# Altium schematic sheet pca20054_sheet5_connectors.SchDoc: PCA20054 - Connectors
size A3; Organization: Nordic Semiconductor; DocumentNumber: 1; Revision: 1.0.0; SheetNumber: 5; SheetTotal: 5; Date: 2020-02-07; CompanyName: Nordic Semiconductor; DrawnBy: KJP; ProjectNumber: 4467
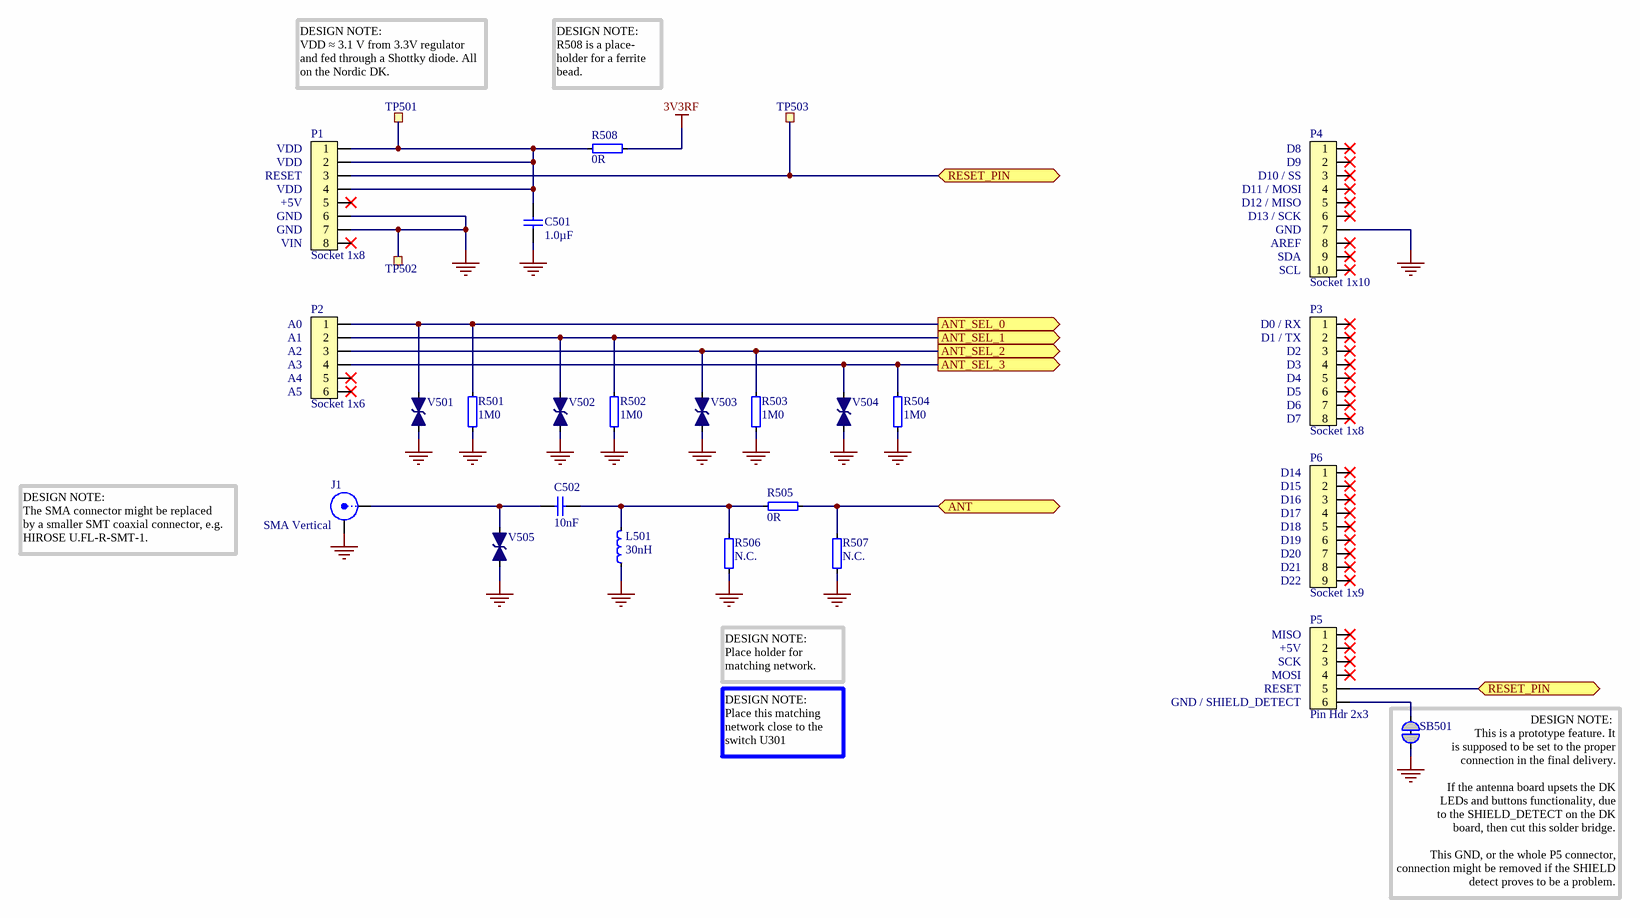
[diagram p0: pca20054_sheet5_connectors.SchDoc]

## Parts
C501  1.0µF  [CAPC1608X06L]
C502  10nF  [CAPC1005X04L]
J1  SMA Vertical  [CON_SMA_COAX_FEM_STRAIGHT_5P_1]
L501  30nH  [INDC1005X04L_WW]
P1  Socket 1x8  [SOCKET_1x8_SMD]
P2  Socket 1x6  [SOCKET_1x6_SMD]
P3  Socket 1x8  [SOCKET_1x8_SMD]
P4  Socket 1x10  [SOCKET_1x10_SMD]
P5  Pin Hdr 2x3  [HDR_2x3-SMD]
P6  Socket 1x9  [SOCKET_1x9_SMD]
R501  1M0  [RESC1005X04L]
R502  1M0  [RESC1005X04L]
R503  1M0  [RESC1005X04L]
R504  1M0  [RESC1005X04L]
R505  0R  [RESC1005X04L]
R506  N.C.  [RESC1005X04L_NC]
R507  N.C.  [RESC1005X04L_NC]
R508  0R  [RESC1005X04L]
SB501  Solderbridge  [Solderbridge_Shorted_Power]  (value not drawn)  (net tie, no BOM)
TP501  Ø1.0mm,SMD  [TP_SMD_Ø1.0mm]  (value not drawn)  (no BOM)
TP502  Ø1.0mm,SMD  [TP_SMD_Ø1.0mm]  (value not drawn)  (no BOM)
TP503  Ø1.0mm,SMD  [TP_SMD_Ø1.0mm]  (value not drawn)  (no BOM)
V501  LXES15AAA1-133  [RESC1005X04L]  (value not drawn)
V502  LXES15AAA1-133  [RESC1005X04L]  (value not drawn)
V503  LXES15AAA1-133  [RESC1005X04L]  (value not drawn)
V504  LXES15AAA1-133  [RESC1005X04L]  (value not drawn)
V505  LXES15AAA1-133  [RESC1005X04L]  (value not drawn)

## Ports
ANT (bidir), ANT_SEL_0 (out), ANT_SEL_1 (out), ANT_SEL_2 (out), ANT_SEL_3 (out), RESET_PIN (bidir)

## Nets
3V3RF: R508.2
GND: C501.1 J1.2(Y) L501.1 P1.6 P1.7 P4.7 R501.1 R502.1 R503.1 R504.1 R506.1 R507.1 SB501.2 TP502.1 V501.2 V502.2 V503.2 V504.2 V505.2
ANT: R505.2 R507.2 ; port ANT
ANT_SEL_0: P2.1 R501.2 V501.1 ; port ANT_SEL_0
ANT_SEL_1: P2.2 R502.2 V502.1 ; port ANT_SEL_1
ANT_SEL_2: P2.3 R503.2 V503.1 ; port ANT_SEL_2
ANT_SEL_3: P2.4 R504.2 V504.1 ; port ANT_SEL_3
RESET_PIN: P1.3 P5.5 TP503.1 ; port RESET_PIN
NetC501_2: C501.2 P1.1 P1.2 P1.4 R508.1 TP501.1
NetC502_1: C502.1 L501.2 R505.1 R506.2
NetC502_2: C502.2 J1.1(X) V505.1
NetP5_6: P5.6 SB501.1

Not connected (* = marked no-connect by the designer): P1 5* 8*; P2 5* 6*; P3 1* 2* 3* 4* 5* 6* 7* 8*; P4 1* 2* 3* 4* 5* 6* 8* 9* 10*; P5 1* 2* 3* 4*; P6 1* 2* 3* 4* 5* 6* 7* 8* 9*

## Notes on the sheet
- (near TP501) DESIGN NOTE:
  VDD ≈ 3.1 V from 3.3V regulator and fed through a Shottky diode. All on the Nordic DK.
- DESIGN NOTE:
  R508 is a place-
  holder for a ferrite bead.
- (near P1) VDD
- (near P1) RESET
- (near P4) D8
- (near P4) D9
- (near P4) D10 / SS
- (near P4) D11 / MOSI
- (near P1) +5V
- (near P1) GND
- (near P1) VIN
- (near P4) D12 / MISO
- (near P4) D13 / SCK
- (near P4) GND
- (near P4) AREF
- (near P4) SDA
- (near P4) SCL
- (near P2) A0
- (near P3) D0 / RX
- (near P2) A1
- (near P2) A2
- (near P2) A3
- (near P2) A4
- (near P2) A5
- (near P3) D1 / TX
- (near P3) D2
- (near P3) D3
- (near P3) D4
- (near P3) D5
- (near P3) D6
- (near P3) D7
- (near P6) D14
- (near P6) D15
- (near P6) D16
- (near P6) D17
- (near P6) D18
- (near P6) D19
- DESIGN NOTE:
  The SMA connector might be replaced
  by a smaller SMT coaxial connector, e.g.
  HIROSE U.FL-R-SMT-1.
- (near P6) D20
- (near P6) D21
- (near P6) D22
- (near P5) MISO
- (near P5) +5V
- (near P5) SCK
- (near P5) MOSI
- DESIGN NOTE:
  Place holder for matching network.
- (near P5) RESET
- (near P5) GND / SHIELD_DETECT
- DESIGN NOTE:
  Place this matching network close to the switch U301
- (near SB501) DESIGN NOTE:
  This is a prototype feature. It
  is supposed to be set to the proper
  connection in the final delivery.
  If the antenna board upsets the DK
  LEDs and buttons functionality, due
  to the SHIELD_DETECT on the DK
  board, then cut this solder bridge.
  This GND, or the whole P5 connector, connection might be removed if the SHIELD detect proves to be a problem.
- Size
- Date:
- Project Number
- Sheet         of
- Revision
- File:
- Drawn By:

## Library data of the parts
C501 = C0603-1µ0: Capacitor, X7R, ±10%; Part number IPS: 00000000616; Note: 16V; Artikkelnr Noca: 20039282; Part Number: C0603-1µ0; Manufacturer: *; Manufacturer Part Number: *; ComponentLink1URL: *; ComponentLink1Description: Datasheet; ComponentLink2URL: *; ComponentLink2Description: Supplier link; HelpURL: *; Footprint Doc: 0603; LatestRevisionDate: 2013-06-05; Pin Count: 2; Publisher: Nordic Semiconductor; Published: 2009-05-08; Value: 1.0µF; Supplier 1: *; Supplier Part Number 1: *; Supplier 2: *; Supplier Part Number 2: *
C502 = C0402-10n: Capacitor, X7R, ±10%; Part number IPS: 00000007784; Note: 16V; Artikkelnr Noca: 20039166; Part Number: C0402-10n; Manufacturer: *; Manufacturer Part Number: *; ComponentLink1URL: *; ComponentLink1Description: Datasheet; ComponentLink2URL: *; ComponentLink2Description: Supplier link; HelpURL: *; Footprint Doc: 0402; LatestRevisionDate: 2009-11-23; Pin Count: 2; Publisher: Nordic Semiconductor; Published: 2009-05-08; Value: 10nF; Supplier 1: *; Supplier Part Number 1: *; Supplier 2: *; Supplier Part Number 2: *
J1 = SMA-Vert-Std_Sigma: SMA Vertical connector; Artikkelnr Noca: N.A.; Part Number: SMA-Vert-Std_Sigma; Manufacturer: *; Manufacturer Part Number: *; ComponentLink1URL: *; ComponentLink1Description: Datasheet; ComponentLink2URL: *; ComponentLink2Description: Supplier link; HelpURL: *; Footprint Doc: SMA-VERT; LatestRevisionDate: 2009-12-12; Pin Count: 5; Publisher: Nordic Semiconductor; Published: 2009-12-12; Value: SMA Vertical; Note: SMA vertical; Supplier 1: *; Supplier Part Number 1: *; Supplier 2: *; Supplier Part Number 2: *; Part number IPS: N.A.
L501 = L0402-30n-Wirewound-Murata: Inductor, 270mA, ±2%, 580mΩ, Q=25; Manufacturer: Murata; Manufacturer Part Number: LQW15AN30NG00; Note: -55°C ~ 125°C; Artikkelnr Noca: N.A.; Part Number: L0402-30n-Wirewound-Murata; ComponentLink1URL: https://search.murata.co.jp/Ceramy/image/img/P02/JELF243A-0050.pdf; ComponentLink1Description: Datasheet; ComponentLink2URL: *; ComponentLink2Description: Supplier link; HelpURL: https://psearch.en.murata.com/inductor/product/LQW15AN30NG00%23.html; Footprint Doc: 0402; LatestRevisionDate: 2019-04-16; Pin Count: 2; Publisher: Nordic Semiconductor; Published: 2019-04-16; Value: 30nH; Supplier 1: Digi-Key; Supplier Part Number 1: 490-6802-1-ND; Supplier 2: *; Supplier Part Number 2: *; Part number IPS: N.A.
P1 P3 = Socket 1x8 SMD: Socket 1x8, 2.54mm (100mil), SMD; Manufacturer: W-CON; Manufacturer Part Number: 2171-108MS0CUNR1; Part number IPS: 00000009963; Artikkelnr Noca: 55030002; Part Number: Socket 1x8 SMD; ComponentLink1URL: *; ComponentLink1Description: Datasheet; ComponentLink2URL: *; ComponentLink2Description: Supplier link; HelpURL: *; Footprint Doc: SOCKET_1x8_SMD; LatestRevisionDate: 2017-10-23; Pin Count: 8; Publisher: Nordic Semiconductor; Published: 2016-01-22; Value: Socket 1x8; Note: *; Supplier 1: Cabcon; Supplier Part Number 1: 2171-108MS0CUNR1; Supplier 2: Samtec; Supplier Part Number 2: SSM-108-F-SV-P-TR
P2 = Socket 1x6 SMD: Socket 1x6, 2.54mm (100mil), SMD; Manufacturer: W-CON; Manufacturer Part Number: 2171-106MS0CUNR1; Part number IPS: 00000009964; Artikkelnr Noca: 55030001; Part Number: Socket 1x6 SMD; ComponentLink1URL: *; ComponentLink1Description: Datasheet; ComponentLink2URL: *; ComponentLink2Description: Supplier link; HelpURL: *; Footprint Doc: SOCKET_1x6_SMD; LatestRevisionDate: 2017-10-23; Pin Count: 6; Publisher: Nordic Semiconductor; Published: 2016-01-22; Value: Socket 1x6; Note: *; Supplier 1: Cabcon; Supplier Part Number 1: 2171-106MS0CUNR1; Supplier 2: Samtec; Supplier Part Number 2: SSM-106-F-SV-P-TR
P4 = Socket 1x10 SMD: Socket 1x10, 2.54mm (100mil), SMD; Manufacturer: W-CON; Manufacturer Part Number: 2171-110MS0CUNR1; Part number IPS: 00000009965; Artikkelnr Noca: 55030004; Part Number: Socket 1x10 SMD; ComponentLink1URL: *; ComponentLink1Description: Datasheet; ComponentLink2URL: *; ComponentLink2Description: Supplier link; HelpURL: *; Footprint Doc: SOCKET_1x10_SMD; LatestRevisionDate: 2016-01-22; Pin Count: 10; Publisher: Nordic Semiconductor; Published: 2016-01-22; Value: Socket 1x10; Note: *; Supplier 1: Cabcon; Supplier Part Number 1: 2171-110MS0CUNR1; Supplier 2: Samtec; Supplier Part Number 2: SSM-110-F-SV-P-TR
P5 = Pin Header 2x3 SMD: Pin Header 2x3, 2.54mm (100mil) SMD; Manufacturer: W-CON; Manufacturer Part Number: 1125-1203S0M116R1; Part number IPS: 00000009966; Artikkelnr Noca: 55010007; Part Number: Pin Header 2x3 SMD; ComponentLink1URL: *; ComponentLink1Description: Datasheet; ComponentLink2URL: *; ComponentLink2Description: Supplier link; HelpURL: \\hizz\pro\app9717\Datasheet\connectors\W-CON\1125-12XXXXMXXXXX.PDF; Footprint Doc: HDR_2x3-SMD; LatestRevisionDate: 2016-01-22; Pin Count: 6; Publisher: Nordic Semiconductor; Published: 2016-01-22; Value: Pin Hdr 2x3; Note: SMD; Supplier 1: Cabcon; Supplier Part Number 1: 1125-1203S0M116R1; Supplier 2: Samtec; Supplier Part Number 2: TSM-103-01-L-DV
P6 = Socket 1x9 SMD: Socket 1x9, 2.54mm (100mil), SMD; Manufacturer: W-CON; Manufacturer Part Number: 2171-109MS0CUNR1; Part number IPS: N.A.; Artikkelnr Noca: 55030003; Part Number: Socket 1x9 SMD; ComponentLink1URL: *; ComponentLink1Description: Datasheet; ComponentLink2URL: *; ComponentLink2Description: Supplier link; HelpURL: *; Footprint Doc: SOCKET_1x9_SMD; LatestRevisionDate: 2017-10-23; Pin Count: 9; Publisher: Nordic Semiconductor; Published: 2016-01-22; Value: Socket 1x9; Note: *; Supplier 1: Cabcon; Supplier Part Number 1: 2171-109MS0CUNR1; Supplier 2: Samtec; Supplier Part Number 2: SSM-109-L-SV-P-TR
R501-R504 = R0402-1M0: Resistor, ±1%, 0.063W; Part number IPS: 00000006807; Note: Chip Res 1%; Artikkelnr Noca: 27049145; Part Number: R0402-1M0; Manufacturer: *; Manufacturer Part Number: *; ComponentLink1URL: *; ComponentLink1Description: Datasheet; ComponentLink2URL: *; ComponentLink2Description: Supplier link; HelpURL: *; Footprint Doc: 0402; LatestRevisionDate: 2009-11-23; Pin Count: 2; Publisher: Nordic Semiconductor; Published: 2009-05-08; Value: 1M0; Supplier 1: *; Supplier Part Number 1: *; Supplier 2: *; Supplier Part Number 2: *
R505 R508 = R0402-0R: Resistor, ±5%, 0.063W; Part number IPS: 00000007128; Note: Chip Res 5%; Artikkelnr Noca: 27049000; Part Number: R0402-0R; Manufacturer: *; Manufacturer Part Number: *; ComponentLink1URL: *; ComponentLink1Description: Datasheet; ComponentLink2URL: *; ComponentLink2Description: Supplier link; HelpURL: *; Footprint Doc: 0402; LatestRevisionDate: 2009-11-23; Pin Count: 2; Publisher: Nordic Semiconductor; Published: 2009-05-08; Value: 0R; Supplier 1: Farnell; Supplier Part Number 1: 146-9661; Supplier 2: *; Supplier Part Number 2: *
R506 R507 = R0402-N.C.: Not mounted; Assembly: Not mounted; Note: Chip Res; Artikkelnr Noca: N.A.; Part Number: R0402-N.C.; Manufacturer: *; Manufacturer Part Number: *; ComponentLink1URL: *; ComponentLink1Description: Datasheet; ComponentLink2URL: *; ComponentLink2Description: Supplier link; HelpURL: *; Footprint Doc: 0402; LatestRevisionDate: 2009-05-08; Pin Count: 2; Publisher: Nordic Semiconductor; Published: 2009-05-08; Value: N.C.; Supplier 1: *; Supplier Part Number 1: *; Supplier 2: *; Supplier Part Number 2: *; Part number IPS: N.A.
SB501 = Solderbridge Shorted Power: Shorted Solderbridge Power; Artikkelnr Noca: N.A.; Part Number: Solderbridge Shorted Power; Manufacturer: *; Manufacturer Part Number: *; ComponentLink1URL: *; ComponentLink1Description: Datasheet; ComponentLink2URL: *; ComponentLink2Description: Supplier link; HelpURL: *; Footprint Doc: Solderbridge_Shorted_Power; LatestRevisionDate: 2012-08-07; Pin Count: 2; Publisher: Nordic Semiconductor; Published: 2012-08-07; Value: Solderbridge; Note: *; Supplier 1: *; Supplier Part Number 1: *; Supplier 2: *; Supplier Part Number 2: *; Part number IPS: N.A.
TP501-TP503 = TP_SMD_Ø1.0MM: 1.0mm circular SMD testpad; Manufacturer: Nordic Semiconductor; Artikkelnr Noca: N.A.; Part Number: TP_SMD_Ø1.0MM; Manufacturer Part Number: *; ComponentLink1URL: *; ComponentLink1Description: Datasheet; ComponentLink2URL: *; ComponentLink2Description: Supplier link; HelpURL: *; Footprint Doc: TP_SMD_Ø1.0mm; LatestRevisionDate: 2013-06-11; Pin Count: 1; Publisher: Nordic Semiconductor; Published: 2013-06-11; Value: Ø1.0mm,SMD; Note: *; Supplier 1: *; Supplier Part Number 1: *; Supplier 2: *; Supplier Part Number 2: *; Part number IPS: N.A.
V501-V505 = LXES15AAA1-133: TVS DIODE 15VWM 0402; Manufacturer: Murata; Artikkelnr Noca: N.A.; Part Number: LXES15AAA1-133; Manufacturer Part Number: LXES15AAA1-133; ComponentLink1URL: *; ComponentLink1Description: Datasheet; ComponentLink2URL: *; ComponentLink2Description: Supplier link; HelpURL: http://www.murata.com/en-us/products/productdata/8796832759838/CRESD-E.pdf; Footprint Doc: 0402; LatestRevisionDate: 2017-09-20; Pin Count: 2; Publisher: Nordic Semiconductor; Published: 2017-09-20; Value: LXES15AAA1-133; Note: *; Supplier 1: Digi-Key; Supplier Part Number 1: 490-13209-6-ND; Supplier 2: Mouser; Supplier Part Number 2: 81-LXES15AAA1-133; Part number IPS: N.A.